# EAGLE design freem_v1 (EAGLE 5.10)
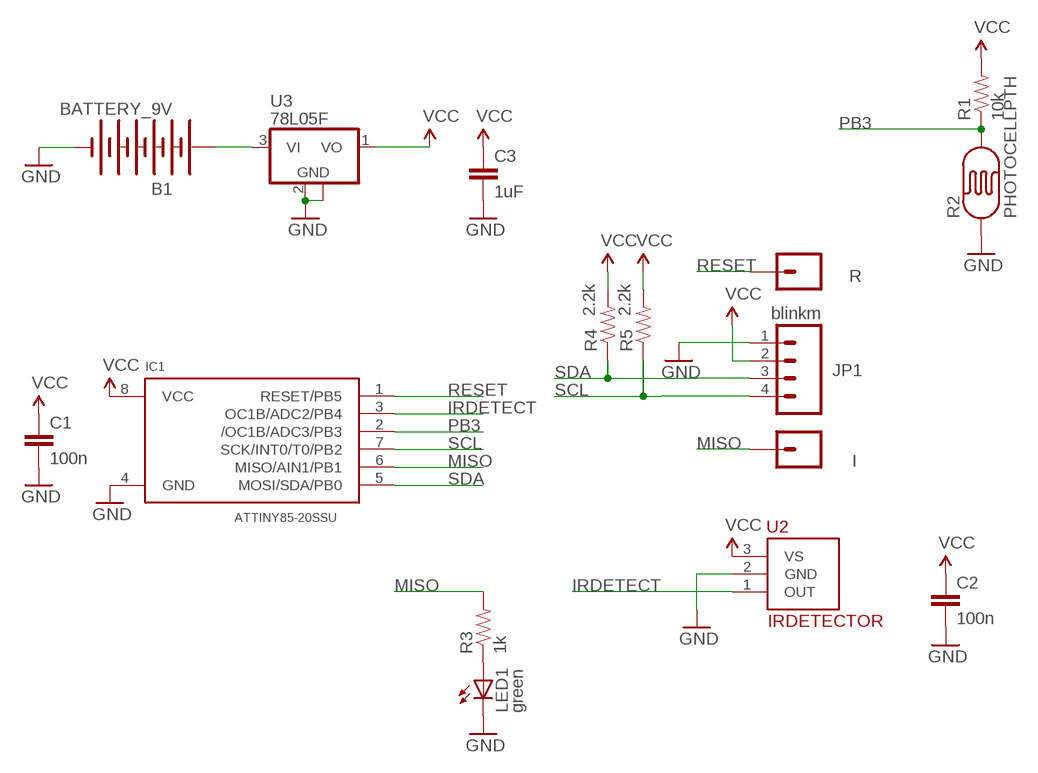
[diagram p0: schematic, sheet 1]

## Parts
B1  BATTERY_9V  [KEYSTONE_968_9V_VERT]
C1  100n  CAP0603-CAP  [0603-CAP]
C2  100n  CAP0603-CAP  [0603-CAP]
C3  1uF  CAP0805  [0805]
I  M01PTH  [1X01]
IC1  ATTINY85-20SSU  ATTINY45SOIC  [SO08-EIAJ]
JP1  blinkm  M04LOCK  [1X04_LOCK]
LED1  green  LED0603  [LED-0603]
R  M01PTH  [1X01]
R1  10k  RESISTOR0603-RES  [0603-RES]
R2  PHOTOCELLPTH  [PHOTOCELL]
R3  1k  RESISTOR0603-RES  [0603-RES]
R4  2.2k  RESISTOR0603-RES  [0603-RES]
R5  2.2k  RESISTOR0603-RES  [0603-RES]
U2  IRDETECTOR  [3PIN-2.54MM]
U3  78L05F  [SOT89]

## Nets
9V: B1.+ U3.3(VI)
GND: B1.- C1.2 C2.2 C3.2 IC1.4(GND) JP1.1 LED1.C R2.1 U2.2(GND) U3.2(GND) U3.2@1(GND)
IRDETECT: IC1.3(OC1B/ADC2/PB4) U2.1(OUT)
MISO: I.1 IC1.6(MISO/AIN1/PB1) R3.2
N$1: LED1.A R3.1
PB3: IC1.2(/OC1B/ADC3/PB3) R1.1 R2.2
RESET: IC1.1(RESET/PB5) R.1
SCL: IC1.7(SCK/INT0/T0/PB2) JP1.4 R5.1
SDA: IC1.5(MOSI/SDA/PB0) JP1.3 R4.1
VCC: C1.1 C2.1 C3.1 IC1.8(VCC) JP1.2 R1.2 R4.2 R5.2 U2.3(VS) U3.1(VO)

## Library data of the parts
B1 = todstuff:BATTERY_9V: Keystone Vertical 9V PC snap-on contact http://www.keyelco.com/products/prod29.asp
C1-C3 = SparkFun-20091103:CAP: Capacitor Standard 0603 ceramic capacitor, and 0.1" leaded capacitor.
I R = SparkFun-20091103:M01: Header 1 Standard 1-pin 0.1" header. Use with straight break away headers (SKU : PRT-00116), right angle break away headers (PRT-00553), swiss pins (PRT-00743), machine pins (PRT-00117), and female headers (PRT-00115).
IC1 = todstuff:ATTINY45
JP1 = SparkFun-20091103:M04: Header 4 Standard 4-pin 0.1" header. Use with straight break away headers (SKU : PRT-00116), right angle break away headers (PRT-00553), swiss pins (PRT-00743), machine pins (PRT-00117), and female headers (PRT-00115). Molex polarized connector foot print use with SKU : PRT-08231 with associated crimp pins and housings.
LED1 = SparkFun-20091103:LED: LEDs Standard schematic elements and footprints for 5mm, 3mm, 1206, and 0603 sized LEDs. 5mm - Spark Fun Electronics SKU : COM-00529 (and others)
R1 R3-R5 = SparkFun-20091103:RESISTOR: Resistor Basic schematic elements and footprints for 0603, 1206, and PTH 1/10th watt (small) resistors.
R2 = SparkFun-20091103:PHOTOCELL
U2 = todstuff:IRDETECTOR: TSOP348, TSOP322, TSOP382, etc
U3 = linear:78L*: POSITOIV-VOLTAGE REGULATORS Output up to 100 mA Source: http://focus.ti.com/lit/ds/symlink/ua78l05.pdf

## Board
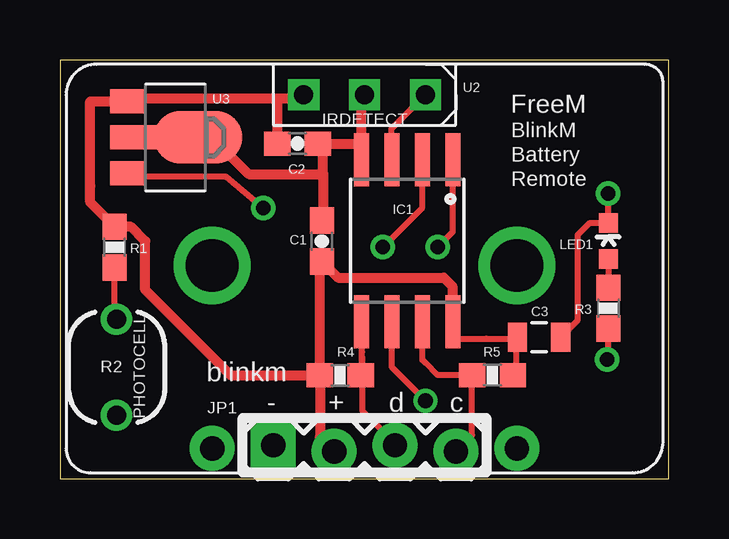
[diagram p1: board, top side]
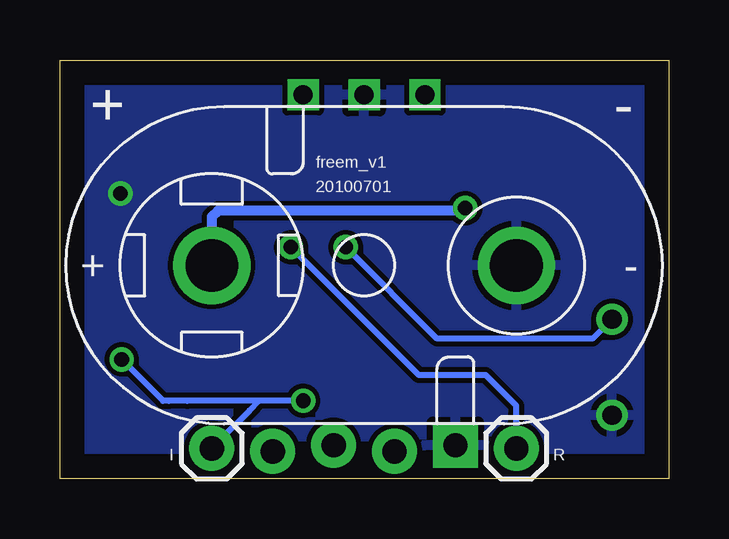
[diagram p2: board, bottom side, seen from below]

Size 25.38 x 17.45 mm. Coordinates in mm from the lower left corner, seen from the top.
Outline: 0,0 25.38,0 25.38,17.45 0,17.45 0,0
Copper layers (1*16): Top 0.035mm / dielectric 1.5mm / Bottom 0.035mm
Design rules "default": minimum track width 10mil, minimum drill 24mil, track to track 8mil, track to pad 8mil, pad to pad 8mil, via to via 8mil, smd to smd 8mil, copper to edge 40mil, drill to drill 8mil, minimum pad ring 10mil, minimum via ring 8mil, stop-mask expansion 4mil, vias tented up to drill 0mil, thermal gap 10mil

### Footprints (pad centres in the part's own frame; a part is rotated, then mirrored left to right if it is on the bottom)
KEYSTONE_968_9V_VERT = drill 2.2 round: + 6.35,0; - -6.35,0
0603-CAP = smd 1.1 x 1: 1 -0.85,0; 2 0.85,0
0805 = smd 0.8 x 1.2: 1 -0.9,0; 2 0.9,0
1X01 = drill 1.016 pad 1.88 round: 1 0,0
SO08-EIAJ = smd 0.61 x 2.21: 1 -1.905,-3.378; 2 -0.635,-3.378; 3 0.635,-3.378; 4 1.905,-3.378; 5 1.905,3.353; 6 0.635,3.353; 7 -0.635,3.353; 8 -1.905,3.353
1X04_LOCK = drill 1.016 pad 1.88 square: 1 0,0.127 | drill 1.016 pad 1.88 round: 2 2.54,-0.127; 3 5.08,0.127; 4 7.62,-0.127
LED-0603 = smd 0.8 x 0.8: A 0,-0.75; C 0,0.75
0603-RES = smd 1.1 x 1: 1 -0.85,0; 2 0.85,0
PHOTOCELL = drill 0.8 round: 1 -2,0; 2 2,0
3PIN-2.54MM = drill 0.8 square: 1 -2.54,0; 2 0,0; 3 2.54,0
SOT89 = smd 1 x 1.5: 1 -1.499,-1.981; 3 1.499,-1.981 | smd 1 x 2: 2 0,-1.727 | smd 2.2 x 3.7: 2@1 0,0.94

### Placement (x,y rotation side)
B1  12.7,8.89 180 bottom
C1  10.92,9.91 90 top
C2  9.91,13.97 0 top
C3  19.98,5.9 0 top
I  19.05,1.27 0 bottom
IC1  14.48,9.91 180 top
JP1  8.89,1.27 0 top
LED1  22.86,9.91 0 top
R  6.35,1.27 0 bottom
R1  2.29,9.65 90 top
R2  2.36,4.65 90 top
R3  22.86,7.11 270 top
R4  11.68,4.32 180 top
R5  18.03,4.32 0 top
U2  12.7,16 180 top
U3  4.83,14.22 270 top

### Tracks (layer width: path | path; a pad name or v marks a point on that pad's centre or on a via)
9V  (via drill 0.61)
  Top 0.254: v8.48,11.28 6.91,12.6 3.25,12.6 U3.3
  Bottom 0.406: B1.+ 19.05,10.92 18.8,11.18 15.95,11.18 8.59,11.18 v8.48,11.28
GND  (via drill 0.61)
  Top 0.254: U3.2 3.25,14.22 5.69,14.22 U3.2@1 6.1,14.22 6.35,14.22 6.5,14.22 | 10.97,11.02 C1.2 | 10.97,14.01 C2.2 | 12.57,13.97 IC1.4 12.57,13.97 | 12.57,16 U2.2 | 12.57,13.97 12.57,14.22 | C3.2 21.59,6.62 21.59,8.89 21.59,10.16 22.1,10.67 22.85,10.67 LED1.C v22.86,11.89
  Top 0.406: 10.97,11.02 10.97,11.89 10.97,12.7 | 6.35,14.22 7.87,12.7 10.16,12.7 10.97,12.7 | 10.97,12.7 10.97,14.01 | 12.57,16 12.57,13.97 C2.2
  pour Bottom: 0,17.78 27.94,17.78 27.94,-1.27 0,-1.27
IRDETECT
  Top 0.254: IC1.3 13.82,13.46 13.82,14.58 U2.1
MISO  (via drill 0.61)
  Top 0.254: IC1.6 13.84,4.65 v15.24,3.25 | 22.81,6.21 R3.2 22.86,5.03 v22.81,4.98
  Bottom 0.254: v15.24,3.25 17.07,3.25 | 17.07,3.25 17.48,2.85 18.69,1.63 I.1 | 17.07,3.25 20.07,3.25 20.83,3.25 21.08,3.25 v22.81,4.98
N$1
  Top 0.254: LED1.A R3.1
PB3  (via drill 0.61)
  Top 0.254: v13.46,9.65 15.11,11.3 IC1.2 | R1.1 2.29,6.72 R2.2
  Bottom 0.254: R2.2 3.17,5.84 6.6,5.84 9.65,5.84 v13.46,9.65
RESET  (via drill 0.61)
  Top 0.254: v15.75,9.65 16.38,10.29 IC1.1
  Bottom 0.254: R.1 6.35,3.05 7.62,4.32 10.41,4.32 v15.75,9.65
SCL
  Top 0.254: IC1.7 15.11,4.95 15.24,4.83 15.75,4.32 R5.1 17.18,1.82 JP1.4
SDA
  Top 0.254: IC1.5 12.6,5.28 12.6,5.08 | JP1.3 13.82,1.63 13.01,2.44 12.6,2.85 12.6,5.08 | R4.1 12.6,4.32 12.6,5.08
VCC
  Top 0.254: 10.16,15.85 U2.3 | U3.1 3.25,15.85 | 16.36,5.69 16.26,6.55 IC1.8 | 16.36,6.5 16.36,6.35 16.36,5.69 | 8.89,15.85 9.06,15.68 | C2.1 8.89,13.97 | 19.02,5.84 17.78,5.84 16.51,5.84 16.36,5.69 | 19.02,5.84 C3.1 | 19.02,5.84 19.02,4.45 R5.2
  Top 0.406: 3.25,15.85 8.89,15.85 10.16,15.85 U2.3 | 9.06,15.68 C2.1 | R4.2 10.83,1.74 JP1.2 | U3.1 1.27,15.72 1.27,12.19 1.27,11.52 R1.2 2.96,10.5 3.56,9.91 3.56,7.87 4.06,7.37 7.11,4.32 R4.2 | R4.2 10.83,8.97 C1.1 11.6,8.38 16,8.38 16.36,8.03 16.36,5.69

### Text on the board
tPlace: IRDETECT | FreeM | BlinkM | Battery | Remote | PHOTOCELL | blinkm | - | + | d | c
bPlace: - | + | freem_v1 | 20100701